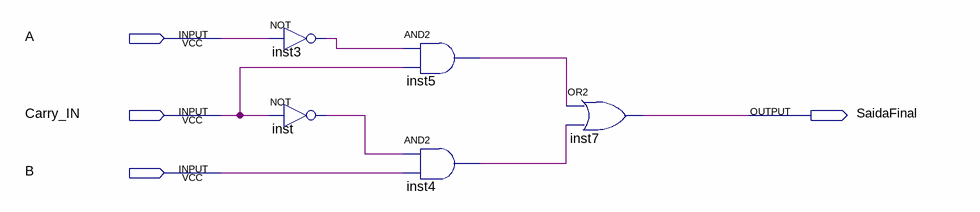
[diagram p0: schematic sheet]
// Quartus schematic Signal.bdf as structural Verilog: 5 symbols, 4 pins
module Signal (
  input  A,
  input  Carry_IN,
  input  B,
  output SaidaFinal
);

  wire inst3_out, inst4_out, inst5_out, inst_out;

  not inst3 (inst3_out, A);
  not inst (inst_out, Carry_IN);
  and inst5 (inst5_out, inst3_out, Carry_IN);
  and inst4 (inst4_out, inst_out, B);
  or inst7 (SaidaFinal, inst5_out, inst4_out);
endmodule
